# EAGLE schematic Digital Dice_Schematic (EAGLE 9.5.2)
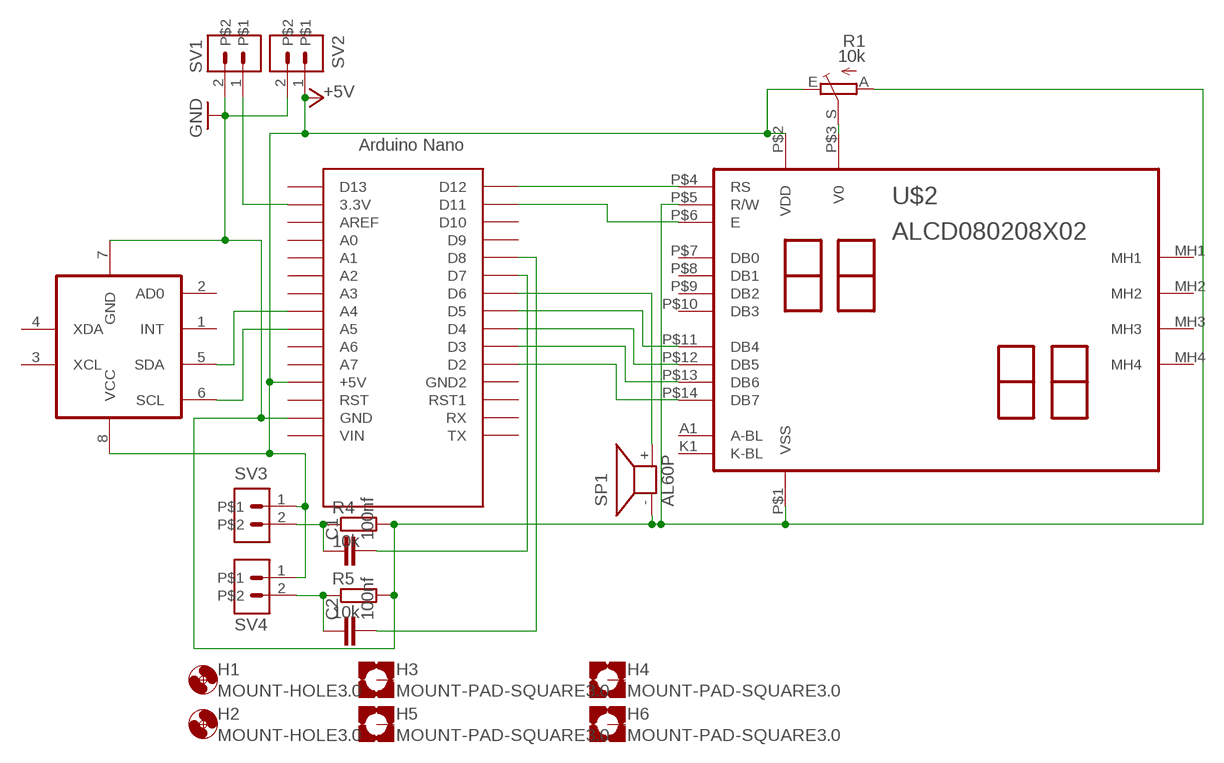
[diagram p0: schematic, sheet 1]

## Parts
C1  100nf  C-EU050-025W  [C050-025X075W]
C2  100nf  C-EU050-025W  [C050-025X075W]
H1  MOUNT-HOLE3.0  [3,0]
H2  MOUNT-HOLE3.0  [3,0]
H3  MOUNT-PAD-SQUARE3.0  [3,0-PAD-SQUARE]
H4  MOUNT-PAD-SQUARE3.0  [3,0-PAD-SQUARE]
H5  MOUNT-PAD-SQUARE3.0  [3,0-PAD-SQUARE]
H6  MOUNT-PAD-SQUARE3.0  [3,0-PAD-SQUARE]
R1  10k  TRIM_EU-CA9V  [CA9V]
R4  10k  R-EU_0207/12  [0207/12]
R5  10k  R-EU_0207/12  [0207/12]
SP1  AL60P  [AL60P]
SV1  MA02-1  [MA02-1]
SV2  MA02-1  [MA02-1]
SV3  MA02-1  [MA02-1]
SV4  MA02-1  [MA02-1]
U$1  NANO  [NANO]
U$2  ALCD080208X02  [ALCD0802]
X1  GYRO_MPU-6050  [MPU]

## Nets
+5V: R1.E SV2.1 SV3.1 SV4.1 U$1.5V(+5V) U$2.P$2(VDD) X1.8(VCC)
GND: R1.A R4.2 R5.2 SP1.- SV1.2 SV2.2 U$1.GND U$2.P$1(VSS) U$2.P$5(R/W) X1.7(GND)
N$1: U$1.D12 U$2.P$4(RS)
N$2: C2.1 R5.1 SV4.2
N$3: U$1.A5 X1.6(SCL)
N$4: U$1.A4 X1.5(SDA)
N$5: R1.S U$2.P$3(V0)
N$6: SV1.1 U$1.3.3V
N$7: C1.1 R4.1 SV3.2
N$8: U$1.D11 U$2.P$6(E)
N$9: U$1.D5 U$2.P$11(DB4)
N$10: U$1.D4 U$2.P$12(DB5)
N$11: U$1.D3 U$2.P$13(DB6)
N$12: U$1.D2 U$2.P$14(DB7)
N$13: SP1.+ U$1.D6
N$14: C1.2 U$1.D7
N$16: C2.2 U$1.D8
Unconnected: H3.B3,0(MOUNT) H4.B3,0(MOUNT) H5.B3,0(MOUNT) H6.B3,0(MOUNT) U$1.A0 U$1.A1 U$1.A2 U$1.A3 U$1.A6 U$1.A7 U$1.AREF U$1.D9 U$1.D10 U$1.D13 U$1.GND1(GND2) U$1.ICSP1 U$1.ICSP2 U$1.ICSP3 U$1.ICSP4 U$1.ICSP5 U$1.ICSP6 U$1.RAW(VIN) U$1.RST U$1.RST1 U$1.RX1(RX) U$1.TX0(TX) U$2.A1(A-BL) U$2.K1(K-BL) U$2.MH1 U$2.MH2 U$2.MH3 U$2.MH4 U$2.P$7(DB0) U$2.P$8(DB1) U$2.P$9(DB2) U$2.P$10(DB3) X1.1(INT) X1.2(AD0) X1.3(XCL) X1.4(XDA)

## Library data of the parts
C1 C2 = bar-rcl:C-EU: CAPACITOR, European symbol
H1 H2 = holes:MOUNT-HOLE: MOUNTING HOLE with drill center marker
H3-H6 = holes:MOUNT-PAD-SQUARE: MOUNTING PAD, square
R1 = bar-rcl:TRIM_EU-: POTENTIOMETER
R4 R5 = bar-rcl:R-EU_: RESISTOR, European symbol
SP1 = bar-lyd:AL60P: SPEAKER Source: Buerklin
SV1-SV4 = bar-con:MA02-1: PIN HEADER
U$1 = bar-atmel:NANO: Arduino Nano
U$2 = bar-diverse:ALCD0802: 2 line 8 character Alphanumeric display
X1 = bar-moduler:GYRO_MPU-6050: .100" (2.54mm) Center Header - 8 Pin